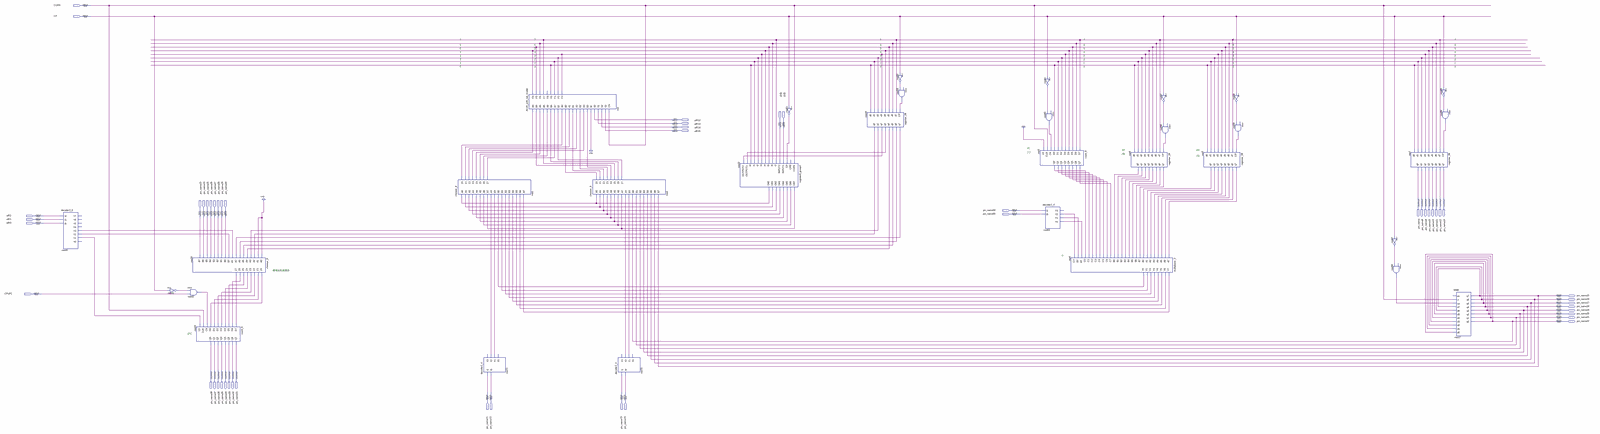
[diagram p0: schematic sheet, whole]
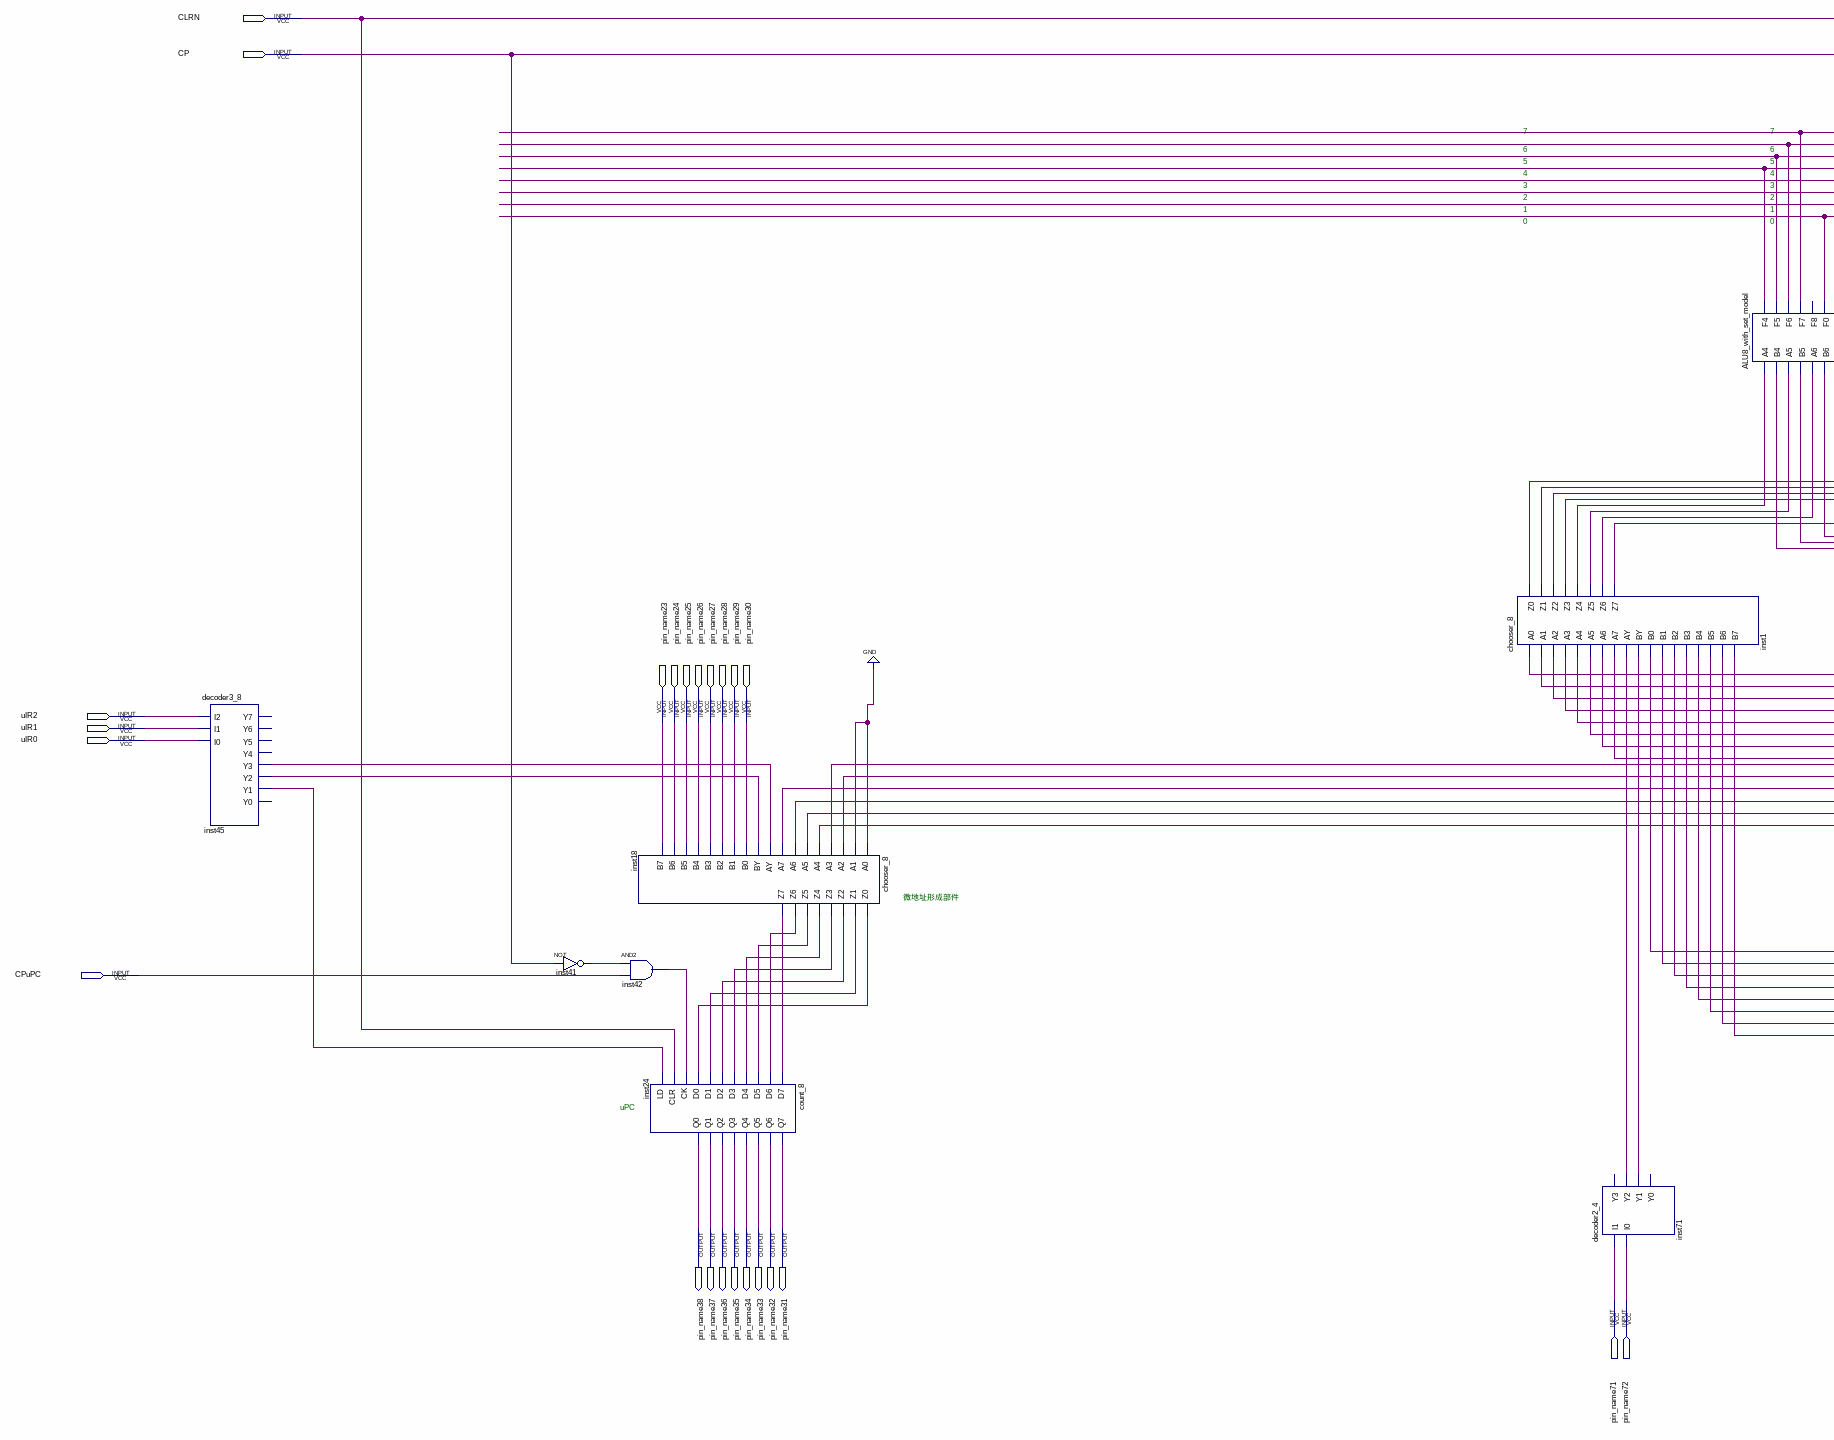
[diagram p1: schematic sheet, left part]
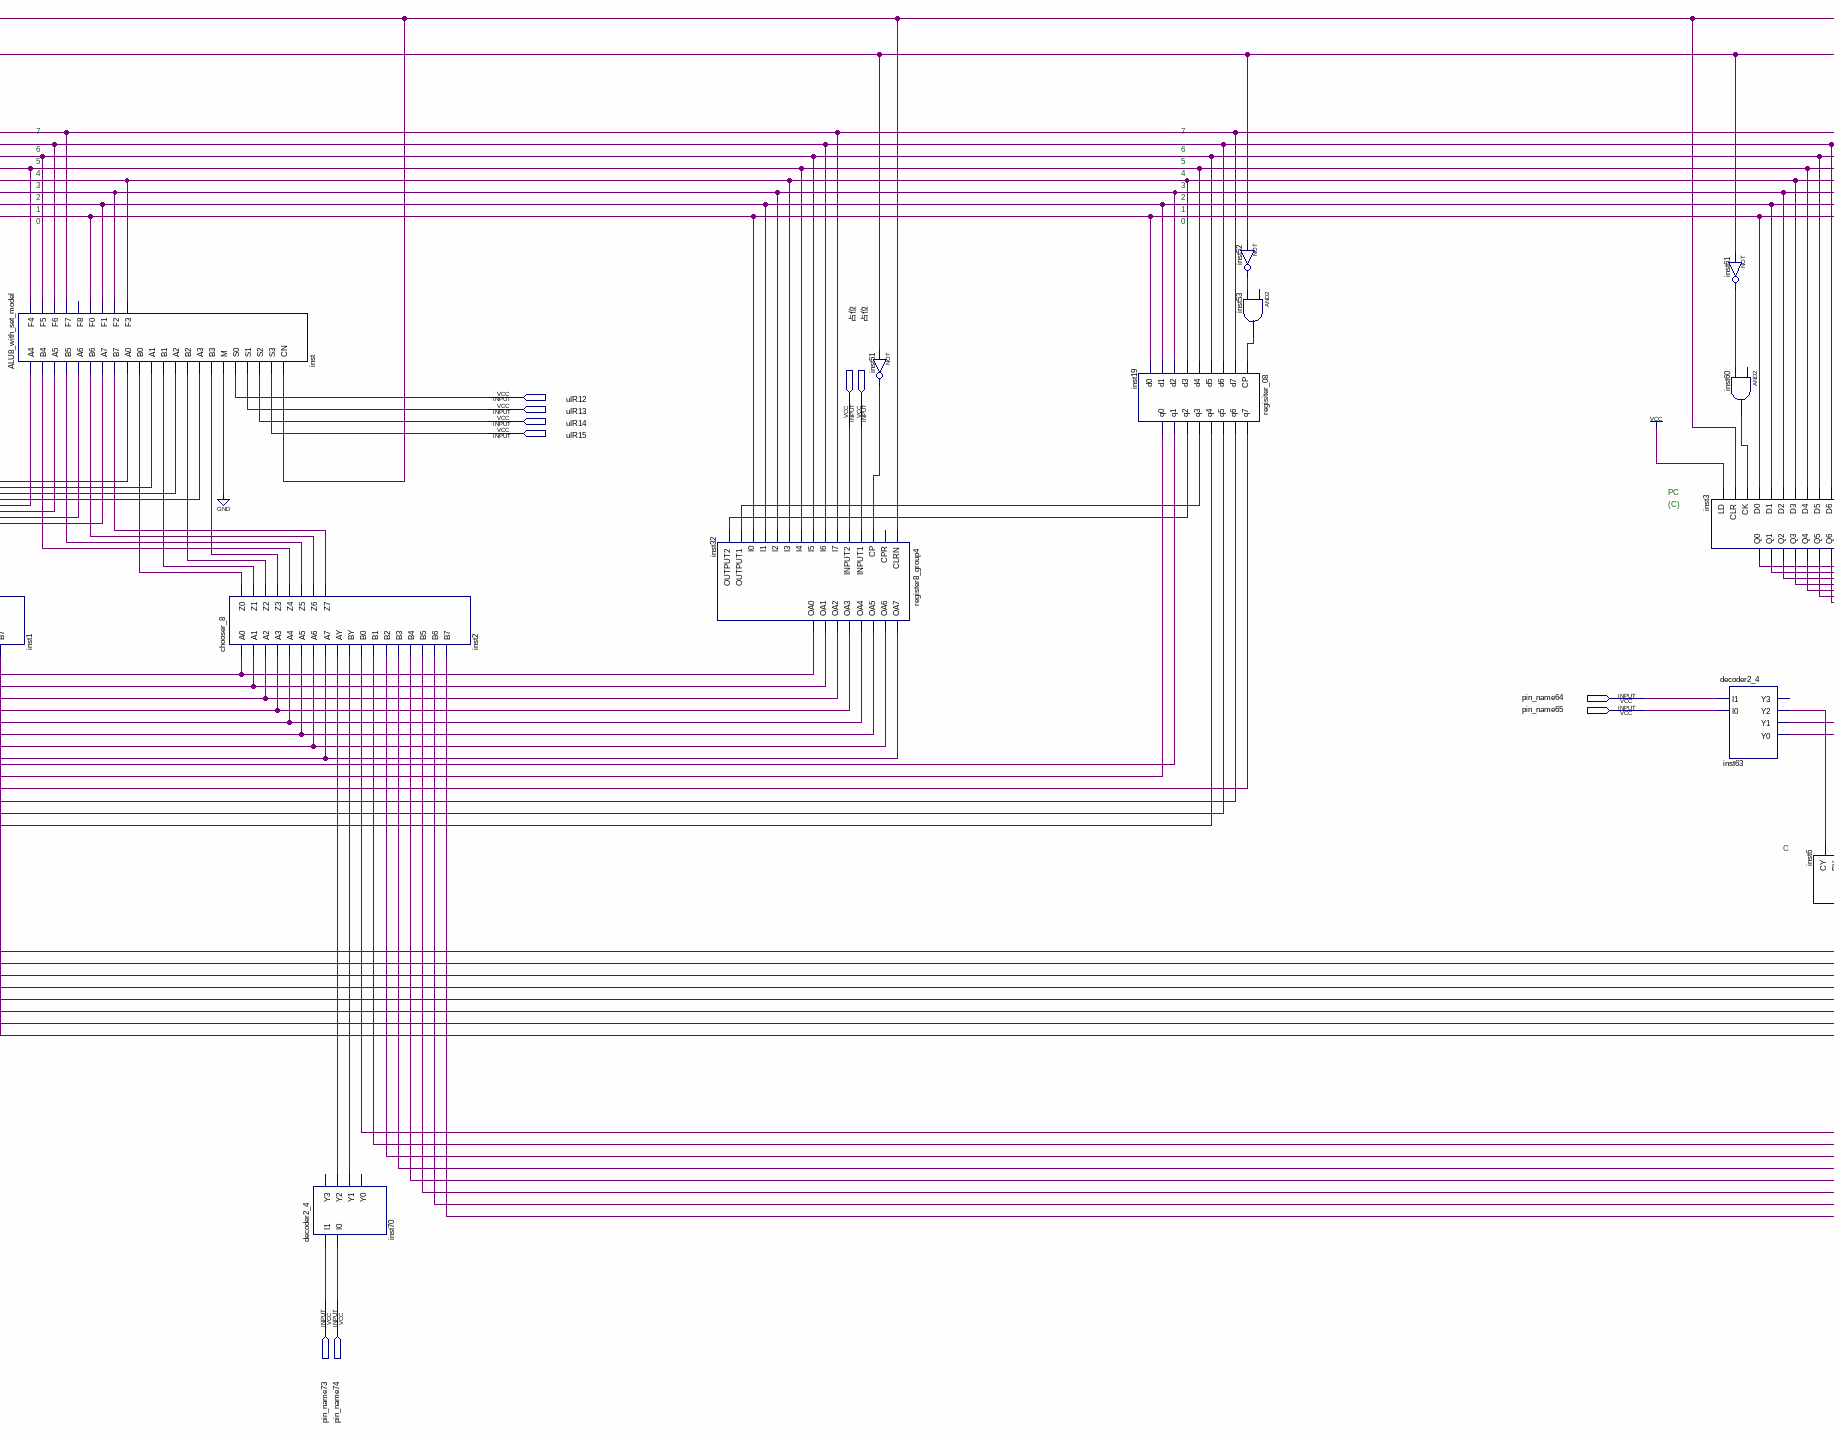
[diagram p2: schematic sheet, centre part]
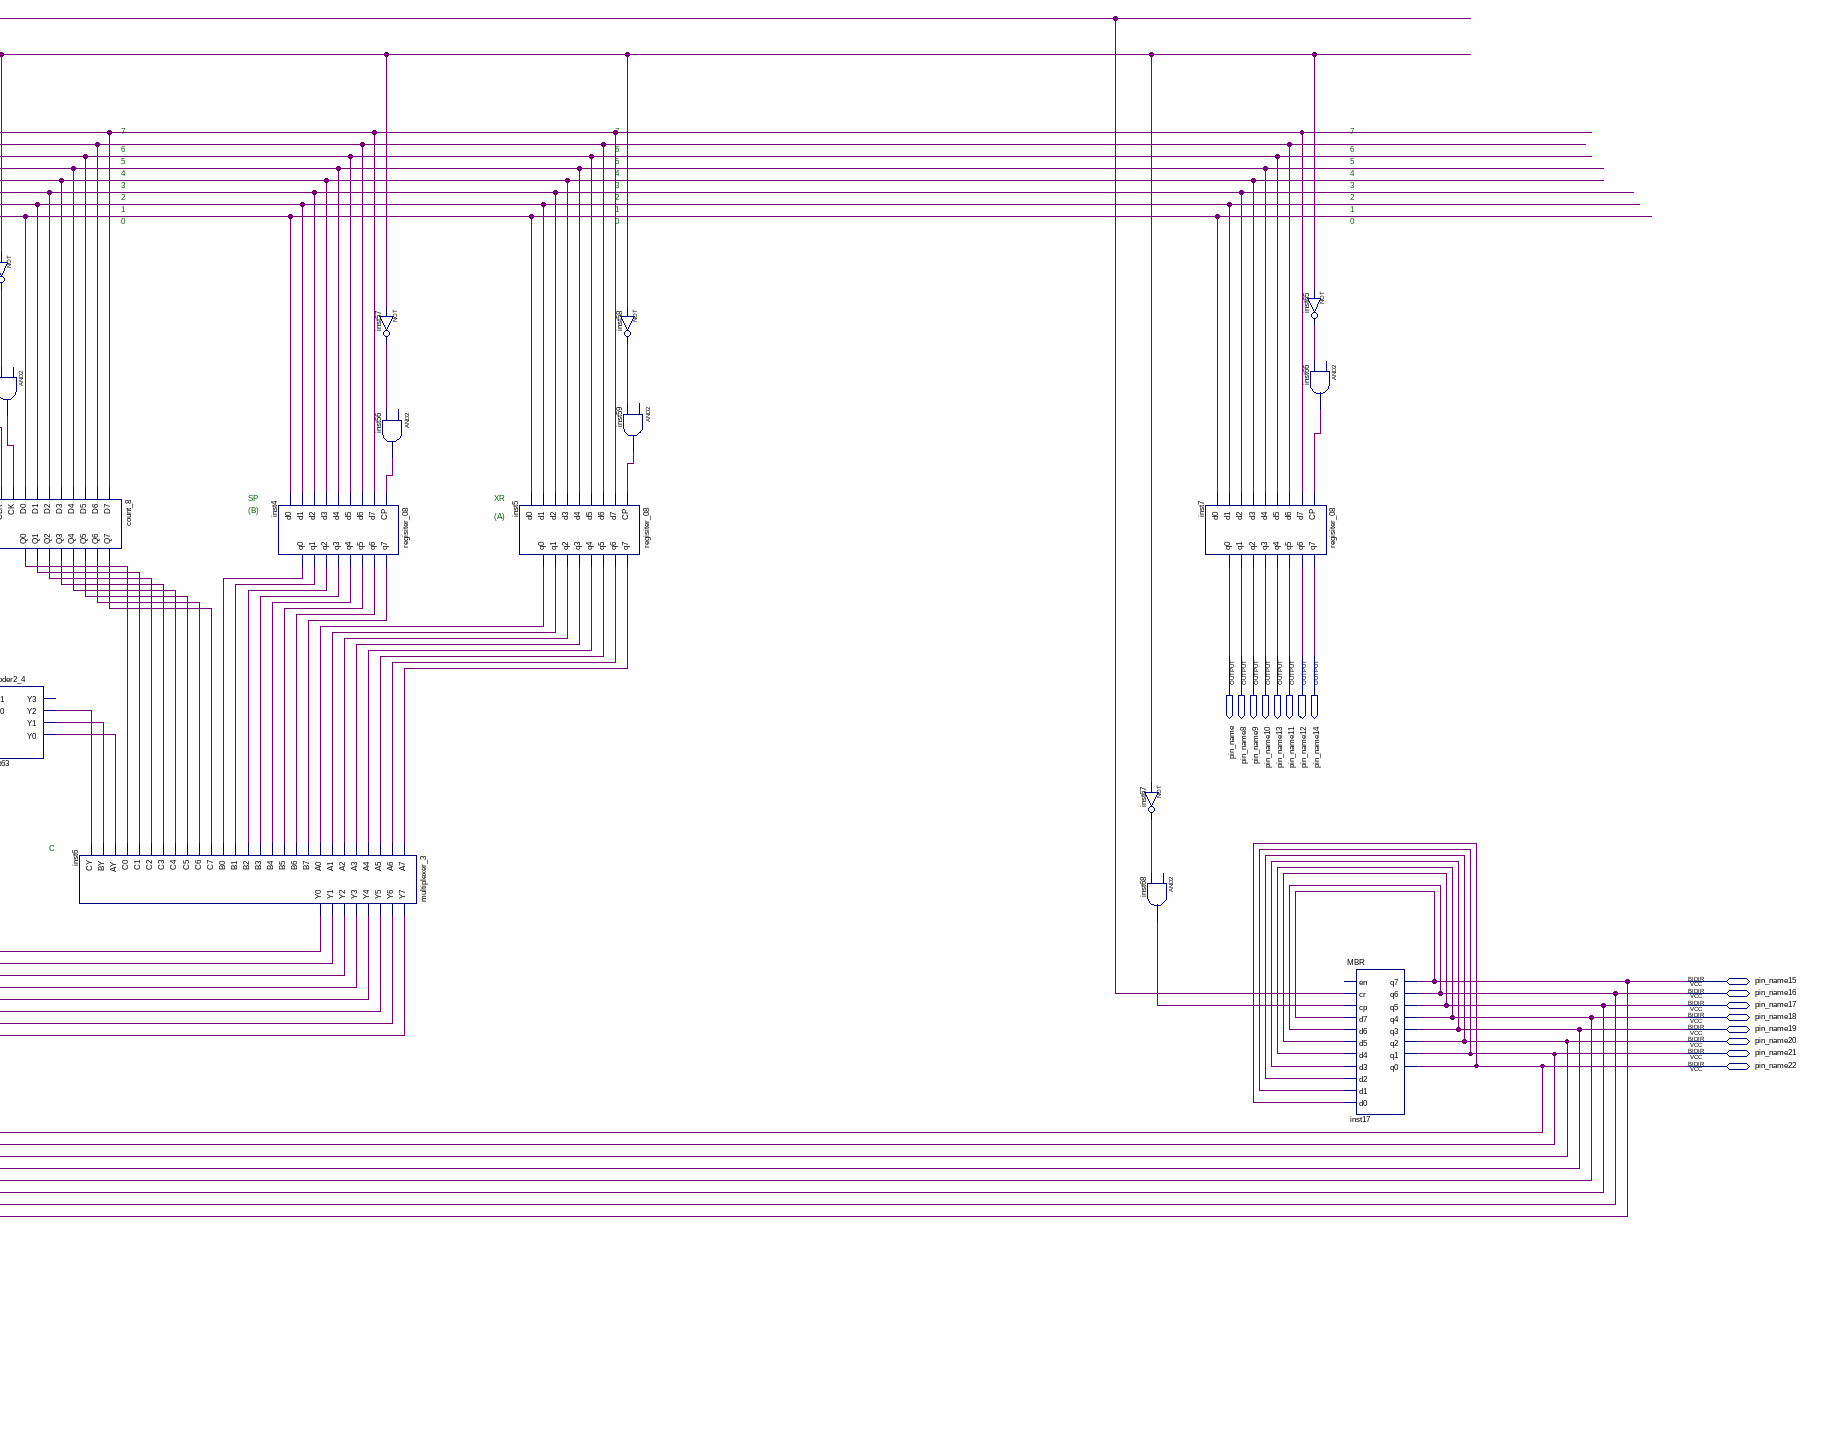
[diagram p3: schematic sheet, right part]
// Quartus schematic machine_advance.bdf as structural Verilog: 32 symbols, 50 pins
module machine_advance (
  input  CLRN,
  input  CP,
  input  uIR12,
  input  uIR13,
  input  uIR14,
  input  \占位 ,
  input  uIR15,
  input  pin_name64,
  input  pin_name65,
  input  uIR2,
  input  pin_name23,
  input  pin_name24,
  input  pin_name25,
  input  pin_name26,
  input  pin_name27,
  input  pin_name28,
  input  pin_name29,
  input  pin_name30,
  input  uIR1,
  input  uIR0,
  input  CPuPC,
  input  pin_name71,
  input  pin_name72,
  input  pin_name73,
  input  pin_name74,
  inout  pin_name15,
  inout  pin_name16,
  inout  pin_name17,
  inout  pin_name18,
  inout  pin_name19,
  inout  pin_name20,
  inout  pin_name21,
  inout  pin_name22,
  output pin_name,
  output pin_name8,
  output pin_name9,
  output pin_name10,
  output pin_name13,
  output pin_name11,
  output pin_name12,
  output pin_name14,
  output pin_name38,
  output pin_name37,
  output pin_name36,
  output pin_name35,
  output pin_name34,
  output pin_name33,
  output pin_name32,
  output pin_name31
);

  wire inst1_z0, inst1_z1, inst1_z2, inst1_z3, inst1_z4, inst1_z5, inst1_z6, inst1_z7, inst2_z0, inst2_z1,
       inst2_z2, inst2_z3, inst2_z4, inst2_z5, inst2_z6, inst2_z7, inst3_q0, inst3_q1, inst3_q2, inst3_q3,
       inst3_q4, inst3_q5, inst3_q6, inst3_q7, inst4_q0, inst4_q1, inst4_q2, inst4_q3, inst4_q4, inst4_q5,
       inst4_q6, inst4_q7, inst5_q0, inst5_q1, inst5_q2, inst5_q3, inst5_q4, inst5_q5, inst5_q6, inst5_q7,
       inst6_y0, inst6_y1, inst6_y2, inst6_y3, inst6_y4, inst6_y5, inst6_y6, inst6_y7, inst18_z0, inst18_z1,
       inst18_z2, inst18_z3, inst18_z4, inst18_z5, inst18_z6, inst18_z7, inst19_q0, inst19_q1, inst19_q2,
       inst19_q3, inst19_q4, inst19_q5, inst19_q6, inst19_q7, inst32_oa0, inst32_oa1, inst32_oa2, inst32_oa3,
       inst32_oa4, inst32_oa5, inst32_oa6, inst32_oa7, inst41_out, inst42_out, inst45_y1, inst45_y2,
       inst45_y3, inst51_out, inst52_out, inst53_out, inst56_out, inst57_out, inst58_out, inst59_out,
       inst60_out, inst61_out, inst63_y0, inst63_y1, inst63_y2, inst65_out, inst66_out, inst67_out,
       inst68_out, inst70_y1, inst70_y2, inst71_y1, inst71_y2, inst_f0, inst_f1, inst_f2, inst_f3, inst_f4,
       inst_f5, inst_f6, inst_f7;

  decoder3_8 inst45 (
    .I2(uIR2), .I1(uIR1), .I0(uIR0), .Y3(inst45_y3), .Y2(inst45_y2), .Y1(inst45_y1));  // open: Y7, Y6, Y5, Y4, Y0
  not inst41 (inst41_out, CP);
  chooser_8 inst18 (
    .A0(1'b0), .A1(1'b0), .A2(inst19_q0), .A3(inst19_q1), .A4(inst19_q4), .A5(inst19_q5), .A6(inst19_q6),
    .A7(inst19_q7), .AY(inst45_y3), .BY(inst45_y2), .B0(pin_name30), .B1(pin_name29), .B2(pin_name28),
    .B3(pin_name27), .B4(pin_name26), .B5(pin_name25), .B6(pin_name24), .B7(pin_name23), .Z0(inst18_z0),
    .Z1(inst18_z1), .Z2(inst18_z2), .Z3(inst18_z3), .Z4(inst18_z4), .Z5(inst18_z5), .Z6(inst18_z6),
    .Z7(inst18_z7));
  and inst42 (inst42_out, inst41_out, CPuPC);
  count_8 inst24 (
    .D7(inst18_z7), .D6(inst18_z6), .D5(inst18_z5), .D4(inst18_z4), .D3(inst18_z3), .D2(inst18_z2),
    .D1(inst18_z1), .D0(inst18_z0), .CK(inst42_out), .CLR(CLRN), .LD(inst45_y1), .Q7(pin_name31),
    .Q6(pin_name32), .Q5(pin_name33), .Q4(pin_name34), .Q3(pin_name35), .Q2(pin_name36), .Q1(pin_name37),
    .Q0(pin_name38));
  chooser_8 inst1 (
    .A0(inst32_oa0), .A1(inst32_oa1), .A2(inst32_oa2), .A3(inst32_oa3), .A4(inst32_oa4), .A5(inst32_oa5),
    .A6(inst32_oa6), .A7(inst32_oa7), .AY(inst71_y2), .BY(inst71_y1), .B0(inst6_y0), .B1(inst6_y1),
    .B2(inst6_y2), .B3(inst6_y3), .B4(inst6_y4), .B5(inst6_y5), .B6(inst6_y6), .B7(inst6_y7), .Z0(inst1_z0),
    .Z1(inst1_z1), .Z2(inst1_z2), .Z3(inst1_z3), .Z4(inst1_z4), .Z5(inst1_z5), .Z6(inst1_z6), .Z7(inst1_z7));
  decoder2_4 inst71 (.I1(pin_name71), .I0(pin_name72), .Y2(inst71_y2), .Y1(inst71_y1));  // open: Y3, Y0
  ALU8_with_set_model inst (
    .A4(inst1_z4), .B4(inst2_z4), .A5(inst1_z5), .B5(inst2_z5), .A6(inst1_z6), .B6(inst2_z6), .A7(inst1_z7),
    .B7(inst2_z7), .A0(inst1_z0), .B0(inst2_z0), .A1(inst1_z1), .B1(inst2_z1), .A2(inst1_z2), .B2(inst2_z2),
    .A3(inst1_z3), .B3(inst2_z3), .M(1'b0), .S0(uIR12), .S1(uIR13), .S2(uIR14), .S3(uIR15), .CN(CLRN),
    .F4(inst_f4), .F5(inst_f5), .F6(inst_f6), .F7(inst_f7), .F0(inst_f0), .F1(inst_f1), .F2(inst_f2),
    .F3(inst_f3));  // open: F8
  chooser_8 inst2 (
    .A0(inst32_oa0), .A1(inst32_oa1), .A2(inst32_oa2), .A3(inst32_oa3), .A4(inst32_oa4), .A5(inst32_oa5),
    .A6(inst32_oa6), .A7(inst32_oa7), .AY(inst70_y2), .BY(inst70_y1), .B0(pin_name22), .B1(pin_name21),
    .B2(pin_name20), .B3(pin_name19), .B4(pin_name18), .B5(pin_name17), .B6(pin_name16), .B7(pin_name15),
    .Z0(inst2_z0), .Z1(inst2_z1), .Z2(inst2_z2), .Z3(inst2_z3), .Z4(inst2_z4), .Z5(inst2_z5), .Z6(inst2_z6),
    .Z7(inst2_z7));
  decoder2_4 inst70 (.I1(pin_name73), .I0(pin_name74), .Y2(inst70_y2), .Y1(inst70_y1));  // open: Y3, Y0
  register8_group4 inst32 (
    .CLRN(CLRN), .CP(inst51_out), .INPUT1(\占位 ), .INPUT2(\占位 ), .I7(inst_f7), .I6(inst_f6), .I5(inst_f5),
    .I4(inst_f4), .I3(inst_f3), .I2(inst_f2), .I1(inst_f1), .I0(inst_f0), .OUTPUT1(inst19_q3),
    .OUTPUT2(inst19_q2), .OA7(inst32_oa7), .OA6(inst32_oa6), .OA5(inst32_oa5), .OA4(inst32_oa4),
    .OA3(inst32_oa3), .OA2(inst32_oa2), .OA1(inst32_oa1), .OA0(inst32_oa0));  // open: CPR
  not inst51 (inst51_out, CP);
  regisiter_08 inst19 (
    .CP(inst53_out), .d7(inst_f7), .d6(inst_f6), .d5(inst_f5), .d4(inst_f4), .d3(inst_f3), .d2(inst_f2),
    .d1(inst_f1), .d0(inst_f0), .q7(inst19_q7), .q6(inst19_q6), .q5(inst19_q5), .q4(inst19_q4),
    .q3(inst19_q3), .q2(inst19_q2), .q1(inst19_q1), .q0(inst19_q0));
  not inst52 (inst52_out, CP);
  buf inst53 (inst53_out, inst52_out);  // AND2 open: IN1
  count_8 inst3 (
    .D7(inst_f7), .D6(inst_f6), .D5(inst_f5), .D4(inst_f4), .D3(inst_f3), .D2(inst_f2), .D1(inst_f1),
    .D0(inst_f0), .CK(inst60_out), .CLR(CLRN), .LD(1'b1), .Q7(inst3_q7), .Q6(inst3_q6), .Q5(inst3_q5),
    .Q4(inst3_q4), .Q3(inst3_q3), .Q2(inst3_q2), .Q1(inst3_q1), .Q0(inst3_q0));
  not inst61 (inst61_out, CP);
  buf inst60 (inst60_out, inst61_out);  // AND2 open: IN1
  decoder2_4 inst63 (.I1(pin_name64), .I0(pin_name65), .Y2(inst63_y2), .Y1(inst63_y1), .Y0(inst63_y0));  // open: Y3
  multiplexer_3 inst6 (
    .A7(inst5_q7), .A6(inst5_q6), .A5(inst5_q5), .A4(inst5_q4), .A3(inst5_q3), .A2(inst5_q2), .A1(inst5_q1),
    .A0(inst5_q0), .B7(inst4_q7), .B6(inst4_q6), .B5(inst4_q5), .B4(inst4_q4), .B3(inst4_q3), .B2(inst4_q2),
    .B1(inst4_q1), .B0(inst4_q0), .C7(inst3_q7), .C6(inst3_q6), .C5(inst3_q5), .C4(inst3_q4), .C3(inst3_q3),
    .C2(inst3_q2), .C1(inst3_q1), .C0(inst3_q0), .AY(inst63_y0), .BY(inst63_y1), .CY(inst63_y2),
    .Y7(inst6_y7), .Y6(inst6_y6), .Y5(inst6_y5), .Y4(inst6_y4), .Y3(inst6_y3), .Y2(inst6_y2), .Y1(inst6_y1),
    .Y0(inst6_y0));
  regisiter_08 inst4 (
    .CP(inst56_out), .d7(inst_f7), .d6(inst_f6), .d5(inst_f5), .d4(inst_f4), .d3(inst_f3), .d2(inst_f2),
    .d1(inst_f1), .d0(inst_f0), .q7(inst4_q7), .q6(inst4_q6), .q5(inst4_q5), .q4(inst4_q4), .q3(inst4_q3),
    .q2(inst4_q2), .q1(inst4_q1), .q0(inst4_q0));
  not inst57 (inst57_out, CP);
  buf inst56 (inst56_out, inst57_out);  // AND2 open: IN1
  regisiter_08 inst5 (
    .CP(inst59_out), .d7(inst_f7), .d6(inst_f6), .d5(inst_f5), .d4(inst_f4), .d3(inst_f3), .d2(inst_f2),
    .d1(inst_f1), .d0(inst_f0), .q7(inst5_q7), .q6(inst5_q6), .q5(inst5_q5), .q4(inst5_q4), .q3(inst5_q3),
    .q2(inst5_q2), .q1(inst5_q1), .q0(inst5_q0));
  not inst58 (inst58_out, CP);
  buf inst59 (inst59_out, inst58_out);  // AND2 open: IN1
  not inst67 (inst67_out, CP);
  buf inst68 (inst68_out, inst67_out);  // AND2 open: IN1
  regisiter_08 inst7 (
    .CP(inst66_out), .d7(inst_f7), .d6(inst_f6), .d5(inst_f5), .d4(inst_f4), .d3(inst_f3), .d2(inst_f2),
    .d1(inst_f1), .d0(inst_f0), .q7(pin_name14), .q6(pin_name12), .q5(pin_name11), .q4(pin_name13),
    .q3(pin_name10), .q2(pin_name9), .q1(pin_name8), .q0(pin_name));
  not inst65 (inst65_out, CP);
  buf inst66 (inst66_out, inst65_out);  // AND2 open: IN1
  MBR inst17 (
    .cr(CLRN), .cp(inst68_out), .d7(pin_name15), .d6(pin_name16), .d5(pin_name17), .d4(pin_name18),
    .d3(pin_name19), .d2(pin_name20), .d1(pin_name21), .d0(pin_name22), .q7(pin_name15), .q6(pin_name16),
    .q5(pin_name17), .q4(pin_name18), .q3(pin_name19), .q2(pin_name20), .q1(pin_name21), .q0(pin_name22));  // open: en

  // Notes on the sheet:
  //   7
  //   7
  //   7
  //   7
  //   7
  //   7
  //   6
  //   6
  //   6
  //   6
  //   6
  //   6
  //   5
  //   5
  //   5
  //   5
  //   5
  //   5
  //   4
  //   4
  //   4
  //   4
  //   4
  //   4
  //   3
  //   3
  //   3
  //   3
  //   3
  //   3
  //   2
  //   2
  //   2
  //   2
  //   2
  //   2
  //   1
  //   1
  //   1
  //   1
  //   1
  //   1
  //   0
  //   0
  //   0
  //   0
  //   0
  //   0
  //   PC
  //   SP
  //   XR
  //   (C)
  //   (B)
  //   (A)
  //   C
  //   微地址形成部件
  //   uPC
endmodule
